# Altium project URM.PrjPcb
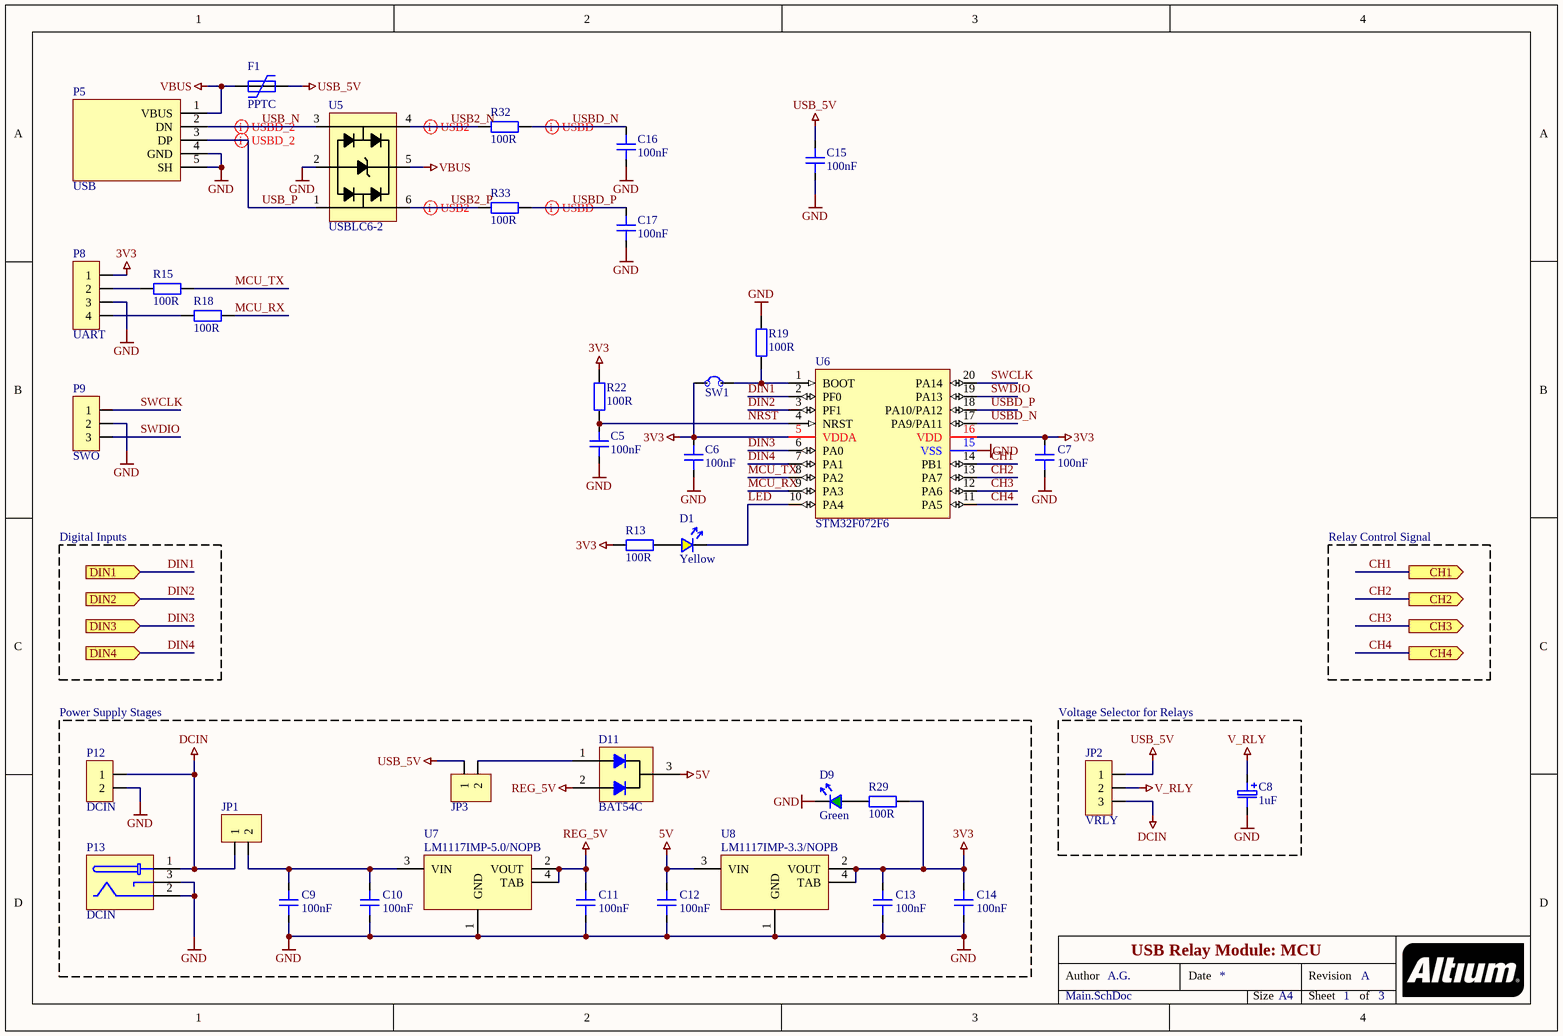
[diagram p0: Main.SchDoc]
3 sheets, 98 parts. Net scope: flat (ports and power ports of the same name join across sheets).
Board file: URM.PcbDoc
Sheets:
  Main.SchDoc
  Inputs.SchDoc
  Relays.SchDoc

## Sheet Main.SchDoc: USB Relay Module: MCU
size A4; DrawnBy: A.G.; DocumentNumber: 1; Revision: A; SheetNumber: 1; SheetTotal: 3

### Parts
C5  100nF  [C0805]
C6  100nF  [C0805]
C7  100nF  [C0805]
C8  1uF  [C_EL_6.3]
C9  100nF  [C0805]
C10  100nF  [C0805]
C11  100nF  [C0805]
C12  100nF  [C0805]
C13  100nF  [C0805]
C14  100nF  [C0805]
C15  100nF  [C0805]
C16  100nF  [C0805]
C17  100nF  [C0805]
D1  Yellow  [LED1206]
D9  Green  [LED1206]
D11  BAT54C  [SOT-23-127P600-8N]
F1  PPTC  [MF-MSMF110/16-2]
JP1  PINHDR_2x1  [HEADER-2.54-2P1]  (value not drawn)
JP2  VRLY  [HEADER-2.54-3P1]
JP3  (no value)  [HEADER-2.54-2P1]
P5  USB  [UJ2-BH-2-TH]
P8  UART  [HEADER-2.54-4P1]
P9  SWO  [HEADER-2.54-3P1]
P12  DCIN  [HEADER-2.54-2P1]
P13  DCIN  [CON JACK PWR 2.5mm PJ-002BH - duplicate]
R13  100R  [R0805]
R15  100R  [R0805]
R18  100R  [R0805]
R19  100R  [R0805]
R22  100R  [R0805]
R29  100R  [R0805]
R32  100R  [R0805]
R33  100R  [R0805]
SW1  SolderBridge-1  [R0805]  (value not drawn)
U5  USBLC6-2  [USBLC6-2-SOT95P280X145-6N]
U6  STM32F072F6  [TSSOP-20]
U7  LM1117IMP-5.0/NOPB  [SOT-223_127P600-8N]
U8  LM1117IMP-3.3/NOPB  [SOT-223_127P600-8N]

### Blocks framed on the sheet
Power Supply Stages: C9-C14 D9 D11 JP1 JP3 P12 P13 R29 U7 U8
Voltage Selector for Relays: C8 JP2

### Ports
CH1 (out), CH2 (out), CH3 (out), CH4 (out), DIN1 (in), DIN2 (in), DIN3 (in), DIN4 (in)

### Nets
3V3: C6.2 C7.2 C13.2 C14.2 P8.1 R13.2 R22.1 R29.2 SW1.1 U6.5(VDDA) U6.16(VDD) U8.2(VOUT) U8.4(TAB)
5V: C12.2 D11.3(C) U8.3(VIN)
DCIN: JP1.1 JP2.3 P12.1 P13.1
GND: C5.1 C6.1 C7.1 C8.2 C9.1 C10.1 C11.1 C12.1 C13.1 C14.1 C15.1 C16.1 C17.1 D9.2(C) P5.4(GND) P5.5(SH) P8.3 P9.2 P12.2 P13.2 P13.3 R19.1 U5.2 U6.15(VSS) U7.1(GND) U8.1(GND)
REG_5V: C11.2 D11.2(A2) U7.2(VOUT) U7.4(TAB)
USB_5V: C15.2 F1.1 JP2.1 JP3.1
V_RLY: C8.1 JP2.2
VBUS: F1.2 P5.1(VBUS) U5.5
CH1: U6.14(PB1) ; port CH1
CH2: U6.13(PA7) ; port CH2
CH3: U6.12(PA6) ; port CH3
CH4: U6.11(PA5) ; port CH4
DIN1: U6.2(PF0) ; port DIN1
DIN2: U6.3(PF1) ; port DIN2
DIN3: U6.6(PA0) ; port DIN3
DIN4: U6.7(PA1) ; port DIN4
LED: D1.2(C) U6.10(PA4)
MCU_RX: R18.2 U6.9(PA3)
MCU_TX: R15.2 U6.8(PA2)
NRST: C5.2 R22.2 U6.4(NRST)
SWCLK: P9.1 U6.20(PA14)
SWDIO: P9.3 U6.19(PA13)
USB2_N: R32.1 U5.4
USB2_P: R33.1 U5.6
USB_N: P5.2(DN) U5.3
USB_P: P5.3(DP) U5.1
USBD_N: C16.2 R32.2 U6.17(PA9/PA11)
USBD_P: C17.2 R33.2 U6.18(PA10/PA12)
NetC9_2: C9.2 C10.2 JP1.2 U7.3(VIN)
NetD1_1: D1.1(A) R13.1
NetD9_1: D9.1(A) R29.1
NetD11_1: D11.1(A1) JP3.2
NetP8_2: P8.2 R15.1
NetP8_4: P8.4 R18.1
NetR19_2: R19.2 SW1.2 U6.1(BOOT)

### Layout directives
differential pair: USB2_N, USB2_P, USB_N, USB_P, USBD_N, USBD_P

### Notes on the sheet
- Digital Inputs
- Relay Control Signal
- Author
- Date
- Revision
- Size
- A4
- Sheet
- of

### Library data of the parts
C5-C7 C9-C17 = C: Generic Capacitor; Tolerance: 20%; Value: 100nF; MountingTechnology: SMT; BaseProduct: *
C8 = CP: Generic Polarized Capacitor; Value: 1uF
D1 = LED_YELLOW: Generic LED (Yellow); ForwardVoltage: 2.1V; EmittingColor: Yellow
D9 = LED_GREEN: Generic LED (Green); ForwardVoltage: 2.1V; EmittingColor: Green
D11 = BAT54C: DIODE ARRAY SCHOTTKY COMM CATH 30V 0.2A SOT-23; PartNo: BAT54C-FDICT-ND; Manufacturer: Diodes Incorporated; DiodeConfiguration: 1 Pair Common Cathode; ProductNumber: BAT54C-7-F; BaseProduct: BAT54C; Supplier: DigiKey; URL: https://www.digikey.com/en/products/detail/diodes-incorporated/BAT54C-7-F/717701; MountingTechnology: SMT; UnitPrice: $0.18; Package: SOT-23-3
F1 = PPTC: PolyFuse (LittleFuse)
JP1 JP3 P12 = PINHDR_2x1: Generic Pin Header 2x1
JP2 P9 = PINHDR_3x1: Generic Pin Header 3x1
P5 = UJ2-BH-2-TH: CONN RCPT USB2.0 TYPEB 4POS R/A; pin to pad: 5>SH; PartNo: 102-5884-ND; Manufacturer: CUI Devices; ProductNumber: UJ2-BH-2-TH; UnitPrice: $0.62; URL: https://www.digikey.com/en/products/detail/cui-devices/UJ2-BH-2-TH/6188079; MountingTechnology: HMT
P8 = PINHDR_4x1: Generic Pin Header 4x1
P13 = PJ-002BH: CONN PWR JACK 2.5X5.5MM SOLDER; Manufacturer: CUI Devices; PartNo: CP-002BH-ND; Supplier: DigiKey; ProductNumber: PJ-002BH; URL: https://www.digikey.com/en/products/detail/cui-devices/PJ-002BH/408447; UnitPrice: $0.74; MountType: THT
R13 R15 R18 R19 R22 R29 R32 R33 = R: Generic Resistor; Tolerance: 1%; Value: 100R; MountingTechnology: SMT; BaseProduct: *
SW1 = SolderBridge-1: PCB Solder Bridge
U5 = USBLC6-2: Low capacitance USB ESD protection
U6 = STM32F072F6P6: IC MCU 32BIT 32KB FLASH 20TSSOP; PartNo: 497-17354-1-ND; ProductNumber: STM32F070F6P6TR; BaseProduct: STM32F07x; URL: https://www.digikey.com/en/products/detail/stmicroelectronics/STM32F070F6P6TR/7313047; Supplier: DigiKey; Package: TSSOP-20; VisibleName: STM32F072F6
U7 = LM1117IMP-5.0/NOPB: IC REG LINEAR 5V 800MA SOT223; PartNo: LM1117IMP-5.0/NOPBCT-ND; Manufacturer: Texas Instruments; DetailedDescription: Linear Voltage Regulator IC Output 800mA SOT-223; ShippingPackage: Cut Tape (CT); MaxInputVoltage: 15V; VoltageDropout: 1.2V; Supplier: DigiKey; URL: https://www.digikey.com/en/products/detail/texas-instruments/LM1117IMP-5-0-NOPB/482940; UnitPrice: $1.10; Package: SOT-223; OutputVoltage: 5V; OutputCurrent: 800mA; ProductNumber: LM1117IMP-5.0/NOPB
U8 = LM1117IMP-3.3/NOPB: IC REG LINEAR 3.3V 800MA SOT223; PartNo: LM1117IMP-3.3/NOPBCT-ND; Manufacturer: Texas Instruments; DetailedDescription: Linear Voltage Regulator IC Output 800mA SOT-223; ShippingPackage: Cut Tape (CT); MaxInputVoltage: 15V; VoltageDropout: 1.2V; Supplier: DigiKey; URL: https://www.digikey.com/en/products/detail/texas-instruments/LM1117IMP-3-3-NOPB/482939; UnitPrice: $1.10; Package: SOT-223; OutputVoltage: 3.3V; OutputCurrent: 800mA; ProductNumber: LM1117IMP-3.3/NOPB

## Sheet Inputs.SchDoc: USB Relay Module: Digital Inputs
size A4; DrawnBy: A.G.; DocumentNumber: 1; Revision: A; SheetNumber: 2; SheetTotal: 3
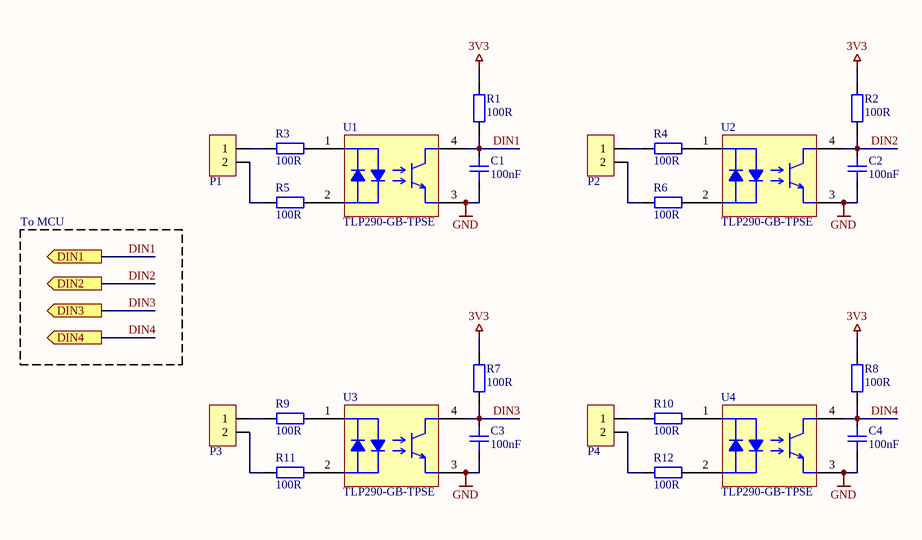
[diagram p1: Inputs.SchDoc]

### Parts
C1  100nF  [C0805]
C2  100nF  [C0805]
C3  100nF  [C0805]
C4  100nF  [C0805]
P1  PINHDR_2x1  [HEADER-2.54-2P1]  (value not drawn)
P2  PINHDR_2x1  [HEADER-2.54-2P1]  (value not drawn)
P3  PINHDR_2x1  [HEADER-2.54-2P1]  (value not drawn)
P4  PINHDR_2x1  [HEADER-2.54-2P1]  (value not drawn)
R1  100R  [R0805]
R2  100R  [R0805]
R3  100R  [R0805]
R4  100R  [R0805]
R5  100R  [R0805]
R6  100R  [R0805]
R7  100R  [R0805]
R8  100R  [R0805]
R9  100R  [R0805]
R10  100R  [R0805]
R11  100R  [R0805]
R12  100R  [R0805]
U1  TLP290-GB-TPSE  [SO-4-SOIC127P600-8N]
U2  TLP290-GB-TPSE  [SO-4-SOIC127P600-8N]
U3  TLP290-GB-TPSE  [SO-4-SOIC127P600-8N]
U4  TLP290-GB-TPSE  [SO-4-SOIC127P600-8N]

### Ports
DIN1 (out), DIN2 (out), DIN3 (out), DIN4 (out)

### Nets
3V3: R1.1 R2.1 R7.1 R8.1
GND: C1.1 C2.1 C3.1 C4.1 U1.3 U2.3 U3.3 U4.3
DIN1: C1.2 R1.2 U1.4 ; port DIN1
DIN2: C2.2 R2.2 U2.4 ; port DIN2
DIN3: C3.2 R7.2 U3.4 ; port DIN3
DIN4: C4.2 R8.2 U4.4 ; port DIN4
NetP1_1: P1.1 R3.2
NetP1_2: P1.2 R5.2
NetP2_1: P2.1 R4.2
NetP2_2: P2.2 R6.2
NetP3_1: P3.1 R9.2
NetP3_2: P3.2 R11.2
NetP4_1: P4.1 R10.2
NetP4_2: P4.2 R12.2
NetR3_1: R3.1 U1.1
NetR4_1: R4.1 U2.1
NetR5_1: R5.1 U1.2
NetR6_1: R6.1 U2.2
NetR9_1: R9.1 U3.1
NetR10_1: R10.1 U4.1
NetR11_1: R11.1 U3.2
NetR12_1: R12.1 U4.2

### Notes on the sheet
- To MCU
- Author
- Date
- Revision
- Size
- A4
- Sheet
- of

### Library data of the parts
C1-C4 = C: Generic Capacitor; Tolerance: 20%; Value: 100nF; MountingTechnology: SMT; BaseProduct: *
P1-P4 = PINHDR_2x1: Generic Pin Header 2x1
R1-R12 = R: Generic Resistor; Tolerance: 1%; Value: 100R; MountingTechnology: SMT; BaseProduct: *
U1-U4 = TLP290-GB-TPSE: OPTOISOLATOR 3.75KV TRANS 4-SO; URL: https://www.digikey.co.uk/product-detail/en/toshiba-semiconductor-and-storage/TLP290-GB-TPSE/TLP290-GB-TPSECT-ND/4562941; MountingTechnology: SMT

## Sheet Relays.SchDoc: USB Relay Module: Relay Outputs
size A4; DrawnBy: Andrew G.; DocumentNumber: 1; Revision: A; SheetNumber: 3; SheetTotal: 3
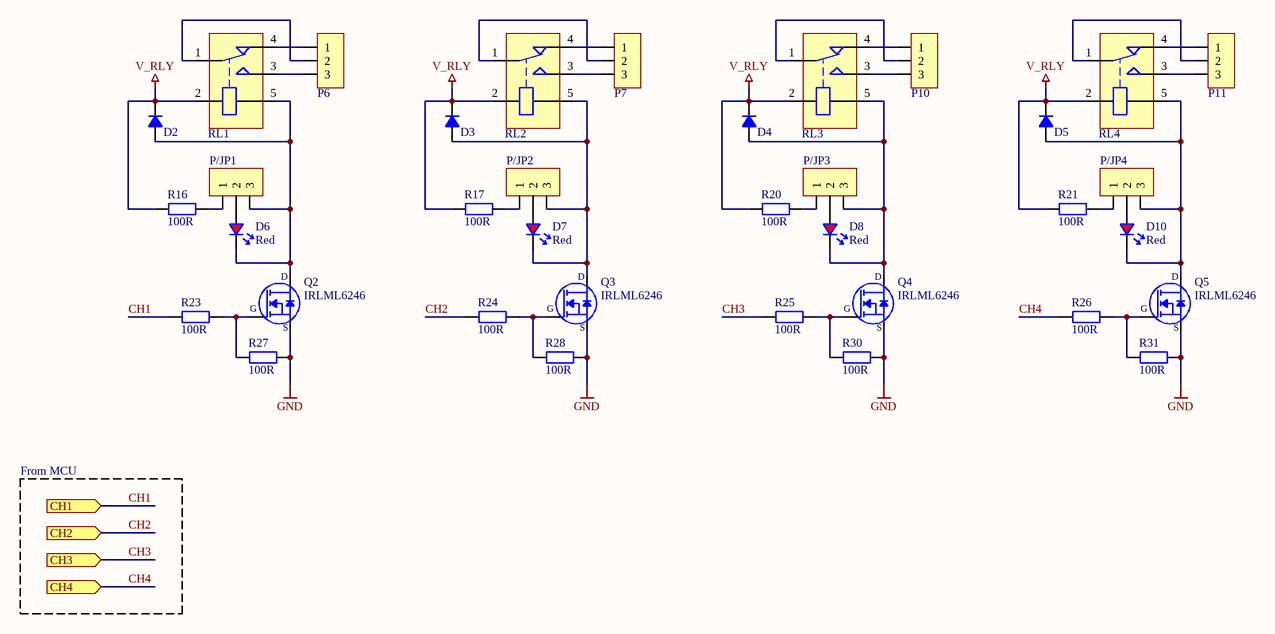
[diagram p2: Relays.SchDoc]

### Parts
D2  D_SM  [DO-214AC]  (value not drawn)
D3  D_SM  [DO-214AC]  (value not drawn)
D4  D_SM  [DO-214AC]  (value not drawn)
D5  D_SM  [DO-214AC]  (value not drawn)
D6  Red  [LED1206]
D7  Red  [LED1206]
D8  Red  [LED1206]
D10  Red  [LED1206]
P6  ED500XDS-3  [ED500XDS-3]  (value not drawn)
P7  ED500XDS-3  [ED500XDS-3]  (value not drawn)
P10  ED500XDS-3  [ED500XDS-3]  (value not drawn)
P11  ED500XDS-3  [ED500XDS-3]  (value not drawn)
P/JP1  PINHDR_3x1  [HEADER-2.54-3P1]  (value not drawn)
P/JP2  PINHDR_3x1  [HEADER-2.54-3P1]  (value not drawn)
P/JP3  PINHDR_3x1  [HEADER-2.54-3P1]  (value not drawn)
P/JP4  PINHDR_3x1  [HEADER-2.54-3P1]  (value not drawn)
Q2  IRLML6246  [SOT-23-127P600-8N]
Q3  IRLML6246  [SOT-23-127P600-8N]
Q4  IRLML6246  [SOT-23-127P600-8N]
Q5  IRLML6246  [SOT-23-127P600-8N]
R16  100R  [R0805]
R17  100R  [R0805]
R20  100R  [R0805]
R21  100R  [R0805]
R23  100R  [R0805]
R24  100R  [R0805]
R25  100R  [R0805]
R26  100R  [R0805]
R27  100R  [R0805]
R28  100R  [R0805]
R30  100R  [R0805]
R31  100R  [R0805]
RL1  *  [SRD-VDC-SL-C]  (value not drawn)
RL2  *  [SRD-VDC-SL-C]  (value not drawn)
RL3  *  [SRD-VDC-SL-C]  (value not drawn)
RL4  *  [SRD-VDC-SL-C]  (value not drawn)

### Ports
CH1 (in), CH2 (in), CH3 (in), CH4 (in)

### Nets
GND: Q2.2(S) Q3.2(S) Q4.2(S) Q5.2(S) R27.1 R28.1 R30.1 R31.1
V_RLY: D2.2(C) D3.2(C) D4.2(C) D5.2(C) R16.2 R17.2 R20.2 R21.2 RL1.2(SW2) RL2.2(SW2) RL3.2(SW2) RL4.2(SW2)
CH1: R23.2 ; port CH1
CH2: R24.2 ; port CH2
CH3: R25.2 ; port CH3
CH4: R26.2 ; port CH4
NetD2_1: D2.1(A) D6.2(C) P/JP1.3 Q2.3(D) RL1.5(SW1)
NetD3_1: D3.1(A) D7.2(C) P/JP2.3 Q3.3(D) RL2.5(SW1)
NetD4_1: D4.1(A) D8.2(C) P/JP3.3 Q4.3(D) RL3.5(SW1)
NetD5_1: D5.1(A) D10.2(C) P/JP4.3 Q5.3(D) RL4.5(SW1)
NetD6_1: D6.1(A) P/JP1.2
NetD7_1: D7.1(A) P/JP2.2
NetD8_1: D8.1(A) P/JP3.2
NetD10_1: D10.1(A) P/JP4.2
NetP6_1: P6.1 RL1.4(NC)
NetP6_2: P6.2 RL1.1(COM)
NetP6_3: P6.3 RL1.3(NO)
NetP7_1: P7.1 RL2.4(NC)
NetP7_2: P7.2 RL2.1(COM)
NetP7_3: P7.3 RL2.3(NO)
NetP10_1: P10.1 RL3.4(NC)
NetP10_2: P10.2 RL3.1(COM)
NetP10_3: P10.3 RL3.3(NO)
NetP11_1: P11.1 RL4.4(NC)
NetP11_2: P11.2 RL4.1(COM)
NetP11_3: P11.3 RL4.3(NO)
NetP/JP1_1: P/JP1.1 R16.1
NetP/JP2_1: P/JP2.1 R17.1
NetP/JP3_1: P/JP3.1 R20.1
NetP/JP4_1: P/JP4.1 R21.1
NetQ2_1: Q2.1(G) R23.1 R27.2
NetQ3_1: Q3.1(G) R24.1 R28.2
NetQ4_1: Q4.1(G) R25.1 R30.2
NetQ5_1: Q5.1(G) R26.1 R31.2

### Notes on the sheet
- From MCU
- Author
- Date
- Revision
- Size
- A4
- Sheet
- of

### Library data of the parts
D2-D5 = D_SM: Generic Diode (Rectifier)
D6-D8 D10 = LED_RED: Generic LED (Red); ForwardVoltage: 1.8V; EmittingColor: Red
P6 P7 P10 P11 = ED500XDS-3: TERM BLK 3P SIDE ENT 5.08MM PCB; Part No: EDZ500/3DS; Rated Current: 15A; Voltage: 300V; URL: https://www.digikey.com/en/products/detail/on-shore-technology-inc/EDZ500-3DS/250583; Datasheet: http://www.on-shore.com/wp-content/uploads/ED500XDS.pdf; Mounting Technology: HMT
P/JP1-P/JP4 = PINHDR_3x1: Generic Pin Header 3x1
Q2-Q5 = IRLML6246TRPBF: MOSFET N-CH 20V 4.1A SOT-23; PartNo: IRLML6246TRPBFCT-ND; Manufacturer: Infineon Technologies; ShippingPackage: Cut Tape (CT); DetailedDescription: N-Channel 4.1A (Ta) 1.3W (Ta) Surface Mount Micro3™ SOT-23; ProductNumber: IRLML6246TRPBF; Supplier: DigiKey; UnitPrice: $0.38; URL: https://www.digikey.com/en/products/detail/infineon-technologies/IRLML6246TRPBF/2393874; Packaging: SOT-23-3; BaseProduct: IRLML6246
R16 R17 R20 R21 R23-R28 R30 R31 = R: Generic Resistor; Tolerance: 1%; Value: 100R; MountingTechnology: SMT; BaseProduct: *
RL1-RL4 = RELAY-SPDT: General Purpose Power Relay SPDT (1 Form C); Coil Voltage: 12VDC; Coil Type: Non Latching; Switching Voltage: 240VAC 24VDC; Contact Current: 10A; Contact Form: SPDT (1 Form C); Mounting Technology: HMT; Product Number: *

## Nets that join several sheets
3V3: Main (13 pins), Inputs (R1.1 R2.1 R7.1 R8.1)
GND: Main (26 pins), Inputs (8 pins), Relays (8 pins)
V_RLY: Main (C8.1 JP2.2), Relays (12 pins)
CH1: Main (U6.14), Relays (R23.2)
CH2: Main (U6.13), Relays (R24.2)
CH3: Main (U6.12), Relays (R25.2)
CH4: Main (U6.11), Relays (R26.2)
DIN1: Main (U6.2), Inputs (C1.2 R1.2 U1.4)
DIN2: Main (U6.3), Inputs (C2.2 R2.2 U2.4)
DIN3: Main (U6.6), Inputs (C3.2 R7.2 U3.4)
DIN4: Main (U6.7), Inputs (C4.2 R8.2 U4.4)